# EAGLE design resonatev2 (EAGLE 7.2.0)
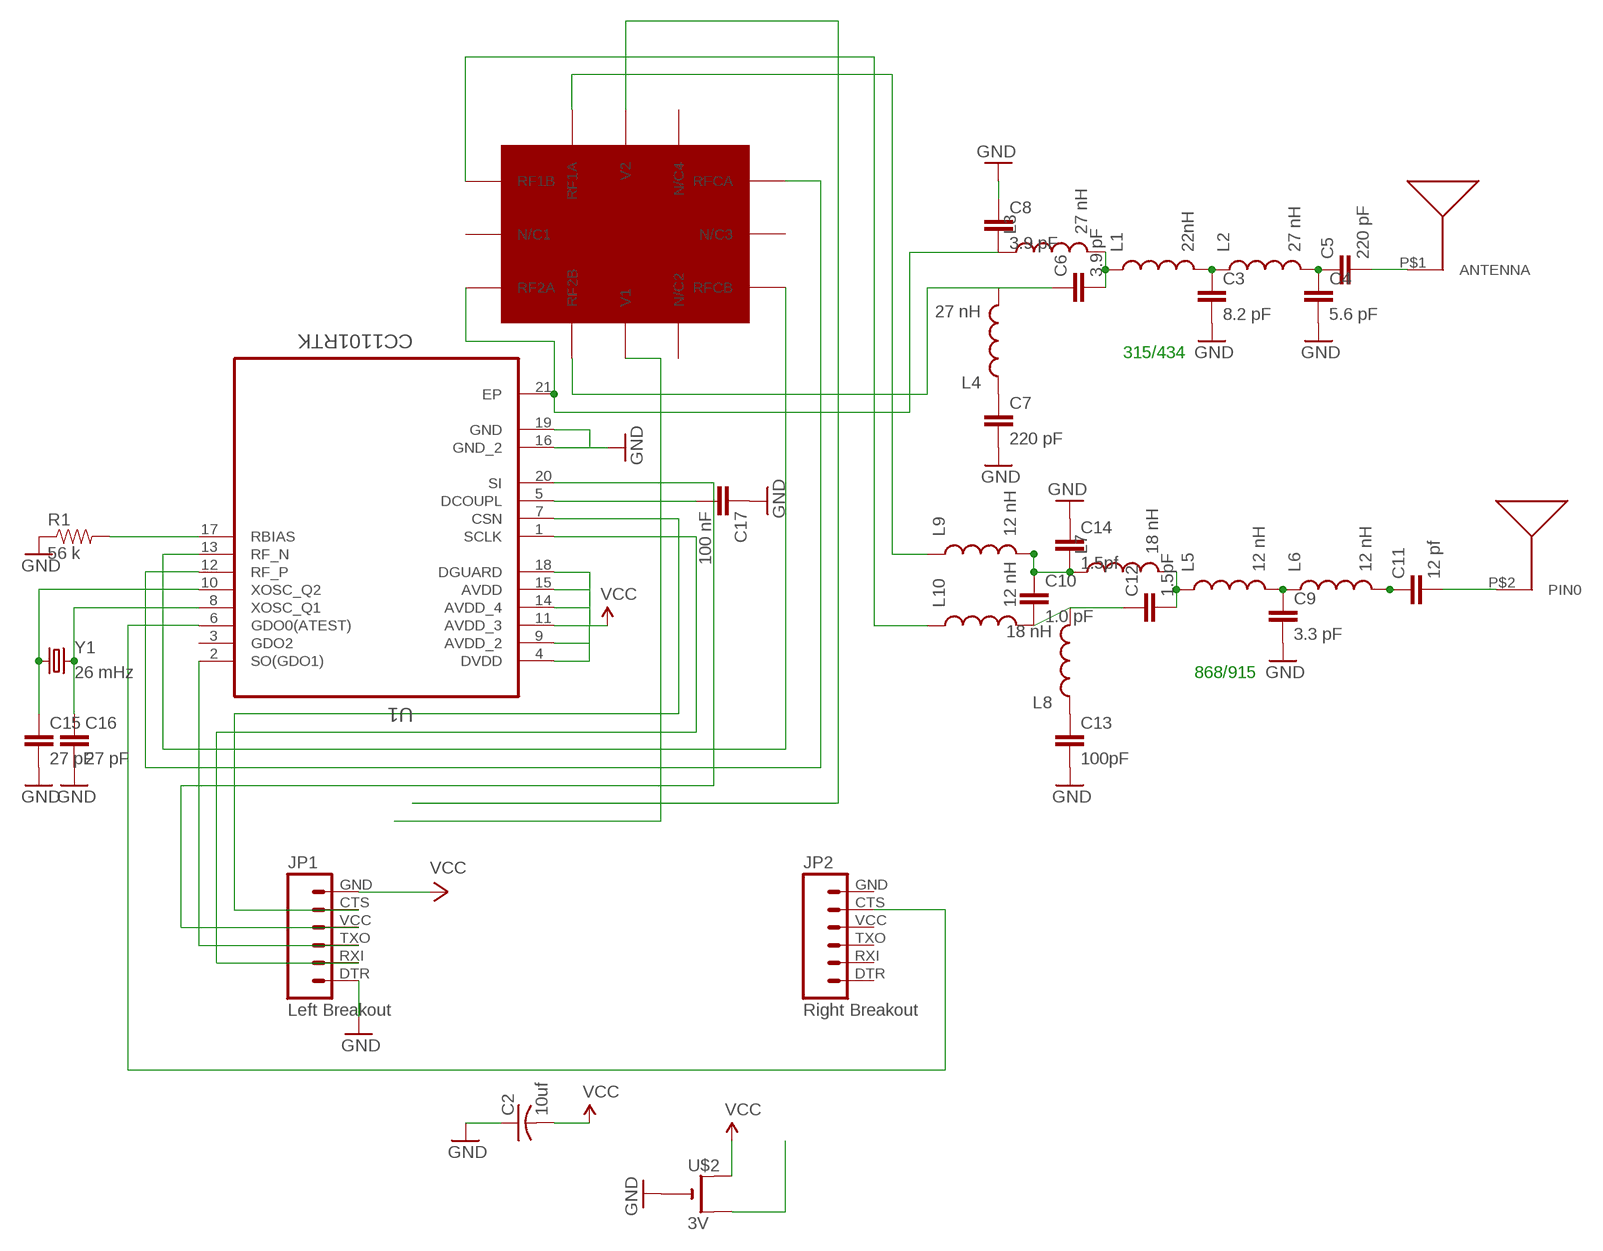
[diagram p0: schematic, sheet 1]

## Parts
C2  10uf  C-USC0603  [C0603]
C3  8.2 pF  CAP0402-CAP  [0402-CAP]
C4  5.6 pF  CAP0402-CAP  [0402-CAP]
C5  220 pF  CAP0402-CAP  [0402-CAP]
C6  3.9 pF  CAP0402-CAP  [0402-CAP]
C7  220 pF  CAP0402-CAP  [0402-CAP]
C8  3.9 pF  CAP0402-CAP  [0402-CAP]
C9  3.3 pF  CAP0402-CAP  [0402-CAP]
C10  1.0 pF  CAP0402-CAP  [0402-CAP]
C11  12 pf  CAP0402-CAP  [0402-CAP]
C12  1.5pF  CAP0402-CAP  [0402-CAP]
C13  100pF  CAP0402-CAP  [0402-CAP]
C14  1.5pf  CAP0402-CAP  [0402-CAP]
C15  27 pF  CAP0402-CAP  [0402-CAP]
C16  27 pF  CAP0402-CAP  [0402-CAP]
C17  100 nF  CAP0402-CAP  [0402-CAP]
JP1  Left Breakout  M06SIP  [1X06]
JP2  Right Breakout  M06SIP  [1X06]
L1  22nH  INDUCTOR0402  [C0402]
L2  27 nH  INDUCTOR0402  [C0402]
L3  27 nH  INDUCTOR0402  [C0402]
L4  27 nH  INDUCTOR0402  [C0402]
L5  12 nH  INDUCTOR0402  [C0402]
L6  12 nH  INDUCTOR0402  [C0402]
L7  18 nH  INDUCTOR0402  [C0402]
L8  18 nH  INDUCTOR0402  [C0402]
L9  12 nH  INDUCTOR0402  [C0402]
L10  12 nH  INDUCTOR0402  [C0402]
R1  56 k  RESISTOR0603-RES  [0603-RES]
U1  CC1101RTK  [QFN50P400X400X90-21N]
U$2  3V  CR2032THM  [CR2032-THRU]
U$3  ANT-868-JJB-ST  [ANT-868-JJB-ST]
U$5  SKY13354-368LF  [SKY13354-368LF]
U$6  ANT1204F002R0433A  [ANT1204F002R0433A]
Y1  26 mHz  CRYSTAL5X3  [CRYSTAL-SMD-5X3]

## Nets
GND: C2.1 C3.2 C4.2 C7.2 C8.1 C9.2 C13.2 C14.1 C15.2 C16.2 C17.1 JP1.DTR R1.1 U1.16(GND_2) U1.19(GND) U$2.-
N$1: U$2.+2(+1)
N$2: JP1.TXO U1.2(SO(GDO1))
N$3: JP2.CTS U1.6(GDO0(ATEST))
N$10: C3.1 L1.2 L2.1
N$11: C4.1 C5.1 L2.2
N$12: C6.1 L4.2 U$5.RF2B
N$13: C7.1 L4.1
N$14: C8.2 L3.1 U1.21(EP) U$5.RF2A
N$15: C9.1 L5.2 L6.1
N$16: C6.2 L1.1 L3.2
N$17: C11.1 L6.2
N$18: C10.2 C12.1 L8.2 L10.2
N$19: C13.1 L8.1
N$20: C10.1 C14.2 L7.1 L9.2
N$21: C12.2 L5.1 L7.2
N$22: C5.2 U$6.P$1(ANTENNA)
N$23: C11.2 U$3.P$2(PIN0)
N$24: U1.12(RF_P) U$5.RFCA
N$25: U1.13(RF_N) U$5.RFCB
N$26: C15.1 U1.10(XOSC_Q2) Y1.1
N$28: L9.1 U$5.RF1A
N$29: L10.1 U$5.RF1B
N$30: C16.1 U1.8(XOSC_Q1) Y1.3
N$31: R1.2 U1.17(RBIAS)
N$32: JP1.VCC U1.20(SI)
N$34: C17.2 U1.5(DCOUPL)
P2: U$5.V1
P3: U$5.V2
P4: JP1.RXI U1.1(SCLK)
P6: JP1.CTS U1.7(CSN)
VCC: C2.2 JP1.GND U1.4(DVDD) U1.9(AVDD_2) U1.11(AVDD_3) U1.14(AVDD_4) U1.15(AVDD) U1.18(DGUARD) U$2.+1(+)
Unconnected: JP2.DTR JP2.GND JP2.RXI JP2.TXO JP2.VCC U1.3(GDO2) U$5.N/C2 U$5.N/C3 U$5.N/C4 U$5.N/C(N/C1)

## Notes on the sheet
- 315/434
- 868/915

## Library data of the parts
C2 = adafruit:C-US: CAPACITOR, American symbol
C3-C17 = SparkFun-Capacitors:CAP: Capacitor Standard 0603 ceramic capacitor, and 0.1" leaded capacitor.
JP1 JP2 = SparkFun-Connectors:M06: Header 6 Standard 6-pin 0.1" header. Use with straight break away headers (SKU : PRT-00116), right angle break away headers (PRT-00553), swiss pins (PRT-00743), machine pins (PRT-00117), and female headers (PRT-00115). Molex polarized connector foot print use with SKU : PRT-08094 with associated crimp pins and housings. NOTES ON THE VARIANTS LOCK and LOCK_LONGPADS... This footprint was designed to help hold the alignment of a through-hole component (i.e. 6-pin header) while soldering it into place. You may notice that each hole has been shifted either up or down by 0.005 of an inch from it's more standard position (which is a perfectly straight line). This slight alteration caused the pins (the squares in the middle) to touch the edges of the holes. Because they are alternating, it causes a "brace" to hold the component in place. 0.005 has proven to be the perfect amount of "off-center" position when using our standard breakaway headers. Although looks a little odd when you look at the bare footprint, once you have a header in there, the alteration is very hard to notice. Also,if you push a header all the way into place, it is covered up entirely on the bottom side. This idea of altering the position of holes to aid alignment will be further integrated into the Sparkfun Library for other footprints. It can help hold any component with 3 or more connection pins.
L1-L10 = SparkFun-Passives:INDUCTOR: Inductors Basic Inductor/Choke - 0603 and 1206. Footprints are not proven and vary greatly between part numbers. SRN6045- 33uH, 20% 1.4A SDR0403-560KL - 56uH, 10%, 500mA RMS/740mA peak
R1 = SparkFun-Passives:RESISTOR: Resistor Basic schematic elements and footprints for 0603, 1206, and PTH resistors.
U1 = Texas Instruments_By_element14_Batch_1:CC1101RTK: Low-Power Sub-1 GHz RF Transceiver; MPN: CC1101RTK; OC_FARNELL: 1555264; OC_NEWARK: 50M8833; PACKAGE: QFN-20; SUPPLIER: Texas Instruments
U$2 = adafruit:CR2032
U$3 = antenna:ANT-868-JJB-ST
U$5 = skyworks:SKY13354-368LF
U$6 = antenna:ANT1204F002R0433A
Y1 = SparkFun-FreqCtrl:CRYSTAL: Various standard crystals. Proven footprints. Spark Fun Electronics SKU : COM-00534

## Board
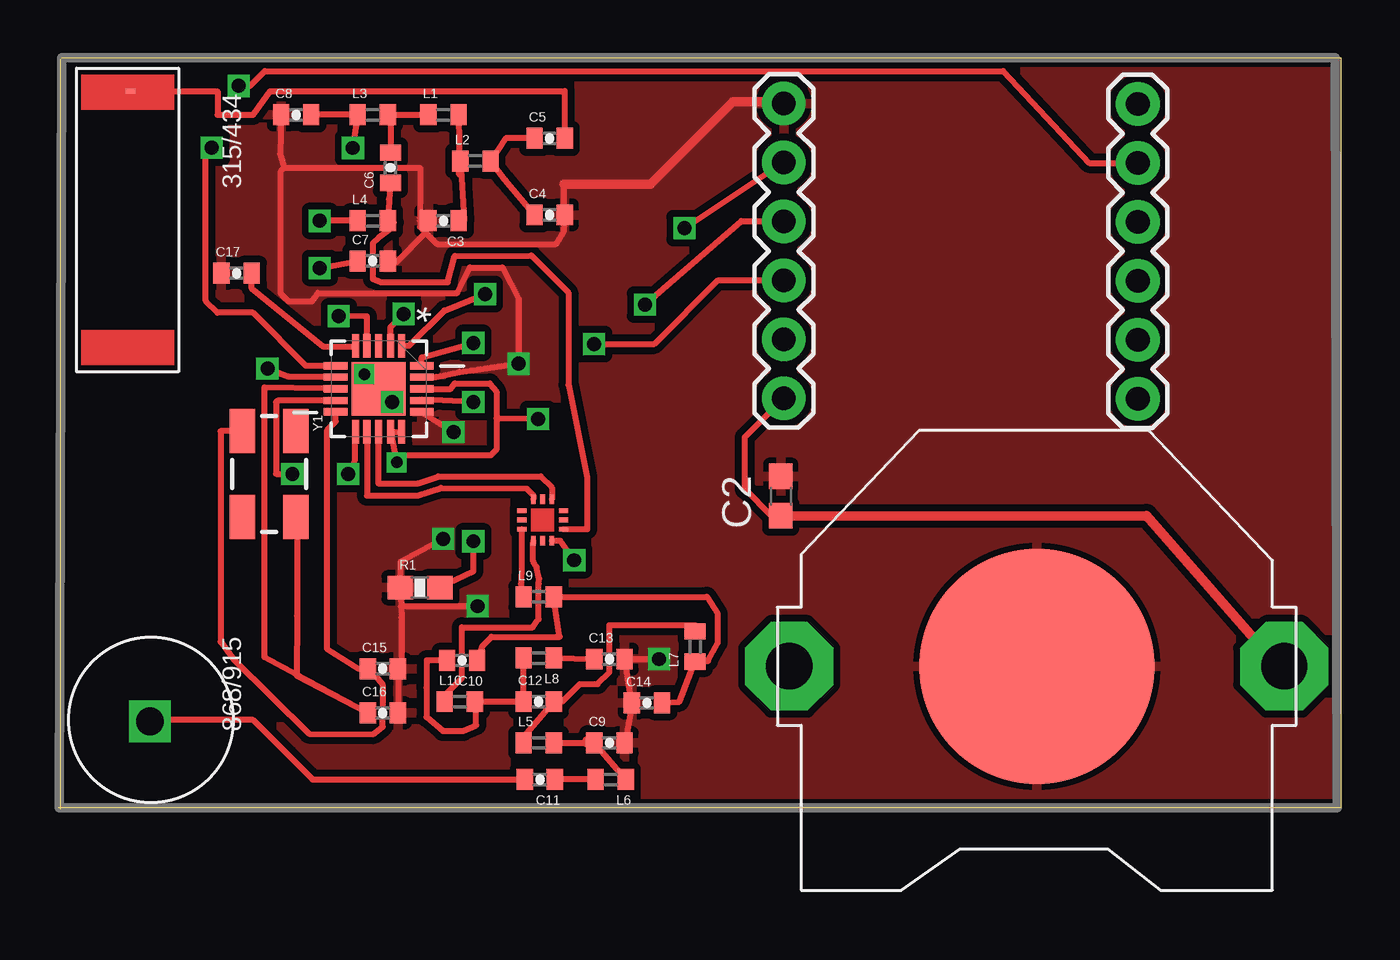
[diagram p1: board, top side]
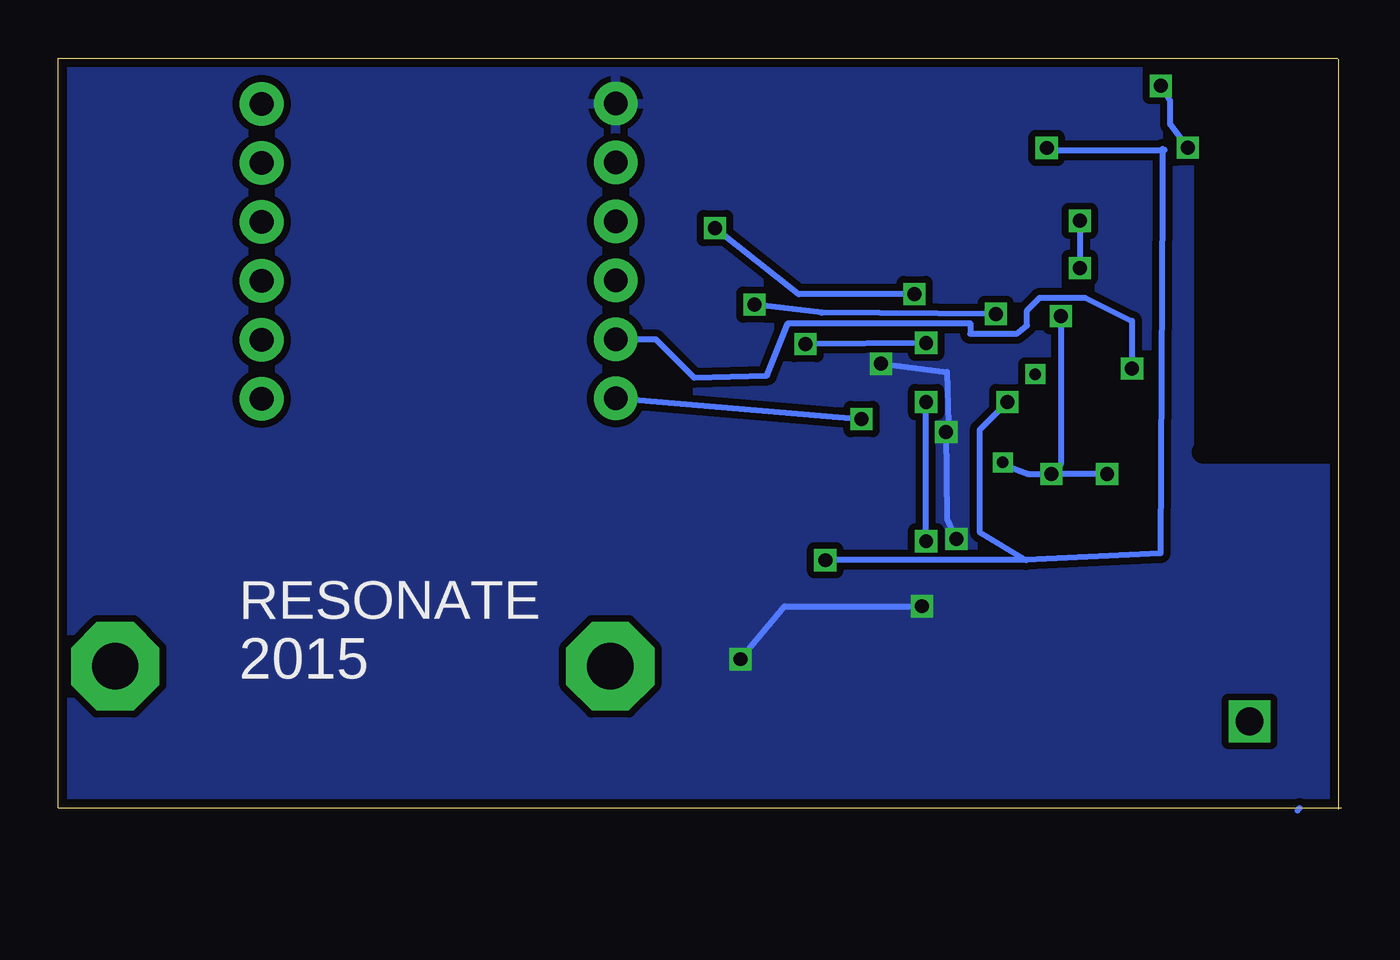
[diagram p2: board, bottom side, seen from below]

Size 55.31 x 32.38 mm. Coordinates in mm from the lower left corner, seen from the top.
Outline: 0.15,32.38 55.31,32.38 55.31,0.05 0,0.05
Outline: 0.11,0 0.11,32.33
Copper layers (1*16): Top 0.0356mm / dielectric 1.5011mm / Bottom 0.0356mm
Design rules "LaenPCBOrder": minimum track width 6mil, minimum drill 13mil, track to track 6mil, track to pad 6mil, pad to pad 6mil, via to via 6mil, smd to smd 6mil, copper to edge 15mil, drill to drill 6mil, minimum pad ring 7mil, minimum via ring 7mil, stop-mask expansion 3mil, vias tented up to drill 0mil, thermal gap 10mil
tRestrict: 4 lines
bRestrict: 4 lines

### Footprints (pad centres in the part's own frame; a part is rotated, then mirrored left to right if it is on the bottom)
C0603 = smd 1.1 x 1: 1 -0.85,0; 2 0.85,0
0402-CAP = smd 0.7 x 0.9: 1 -0.65,0; 2 0.65,0
1X06 = drill 1.016 pad 1.88: CTS 10.16,0; DTR 0,0; GND 12.7,0; RXI 2.54,0; TXO 5.08,0; VCC 7.62,0
C0402 = smd 0.7 x 0.9: 1 -0.65,0; 2 0.65,0
0603-RES = smd 1.1 x 1: 1 -0.85,0; 2 0.85,0
QFN50P400X400X90-21N = smd 1.016 x 0.305: 1 -1.854,0.991; 2 -1.854,0.508; 3 -1.854,0; 4 -1.854,-0.508; 5 -1.854,-0.991; 11 1.854,-0.991; 12 1.854,-0.508; 13 1.854,0; 14 1.854,0.508; 15 1.854,0.991 | smd 0.305 x 1.016: 6 -0.991,-1.854; 7 -0.508,-1.854; 8 0,-1.854; 9 0.508,-1.854; 10 0.991,-1.854; 16 0.991,1.854; 17 0.508,1.854; 18 0,1.854; 19 -0.508,1.854; 20 -0.991,1.854 | smd 2.311 x 2.311: 21 0,0
CR2032-THRU = drill 2 pad 3.81 octagon: +1 -10.668,0; +2 10.668,0 | smd 10.16 x 10.16: - 0,0
ANT-868-JJB-ST = drill 1.2 square: P$2 0.762,-0.762
SKY13354-368LF = smd 0.406 x 0.203: N/C -0.9,0; N/C3 0.9,0; RF1B -0.9,0.4; RF2A -0.9,-0.4; RFCA 0.9,0.4; RFCB 0.9,-0.4 | smd 0.203 x 0.406: N/C2 0.4,-0.9; N/C4 0.4,0.9; RF1A -0.4,0.9; RF2B -0.4,-0.9; V1 0,-0.9; V2 0,0.9
ANT1204F002R0433A = smd 0.203 x 0.406: P$1 0.7,-1.87
CRYSTAL-SMD-5X3 = smd 1.9 x 1.1: 1 -1.85,-1.15; 2 1.85,-1.15; 3 1.85,1.15; 4 -1.85,1.15

### Placement (x,y rotation side)
C2  31.15,13.49 270 top
C3  16.61,25.36 180 top
C4  21.19,25.61 0 top
C5  21.19,28.92 0 top
C6  14.33,27.65 90 top
C7  13.57,23.63 0 top
C8  10.26,29.93 0 top
C9  23.76,2.86 0 top
C10  17.41,6.41 180 top
C11  20.76,1.28 180 top
C12  20.72,4.63 0 top
C13  23.76,6.47 0 top
C14  25.38,4.58 0 top
C15  14,6.05 0 top
C16  14,4.15 0 top
C17  7.69,23.1 0 top
JP1  31.28,30.41 270 top
JP2  46.54,17.69 90 top
L1  16.61,29.93 0 top
L2  17.99,27.94 0 top
L3  13.57,29.93 0 top
L4  13.57,25.36 0 top
L5  20.72,2.86 0 top
L6  23.82,1.28 180 top
L7  27.46,7.01 90 top
L8  20.72,6.51 180 top
L9  20.72,9.15 0 top
L10  17.31,4.63 0 top
R1  15.6,9.55 0 top
U1  13.82,18.12 270 top
U$2  42.18,6.16 180 top
U$3  3.2,4.55 0 top
U$5  20.89,12.46 90 top
U$6  5,31.65 270 top
Y1  9.1,14.45 270 top

### Tracks (layer width: path | path; a pad name or v marks a point on that pad's centre or on a via)
GND  (via drill 0.6)
  Top 0.254: 14.58,23.58 15.85,24.85 | C8.1 9.56,28.24 9.76,27.65 | 9.76,27.65 15.6,27.65 15.6,25.48 C3.2 15.6,25.36 15.6,25.11 15.85,24.85 | 15.85,24.85 16.36,24.34 21.44,24.34 21.79,24.89 C4.2 21.8,25.92 21.8,26.94 | C9.2 24.48,3.04 C14.1 24.66,4.76 C13.2 v25.9,6.47 | C16.2 C15.2 14.8,5.95 14.8,8.25 14.78,8.73 | 14.78,8.73 R1.1 14.75,10.65 v16.6,11.65 | U1.16 v17.04,16.25 | 9.76,27.65 9.6,27.49 9.6,22.22 9.92,21.9 10.95,21.9 11.2,22.25 17.2,22.25 17.75,23.35 19.15,23.35 19.85,22 v19.85,19.2 17.3,18.85 16.3,18.63 U1.19 | v18.08,8.75 14.78,8.73
  Top 0.305: C7.2 14.58,23.58
  Top 0.406: 21.8,26.94 25.54,26.94 29.1,30.5 31.2,30.5 JP1.DTR
  Bottom 0.254: v16.6,11.65 17,12.53 v17.04,16.25 17,16.59 16.95,16.59 17,18.85 v19.85,19.2 | v25.9,6.47 24,8.75 v18.08,8.75
  pour Top (isolate 0.305): 0.15,32.39 55.24,32.39 55.14,0.06 0.05,0.06
  pour Bottom (isolate 0.305): 0.15,32.39 55.24,32.39 55.14,0.06 0.15,0.06
N$2  (via drill 0.6)
  Top 0.254: U1.2 14.33,20.78 v14.9,21.35 | v25.3,21.75 29.45,25.35 31.27,25.35 JP1.TXO
  Bottom 0.254: v14.9,21.35 22.4,21.4 v25.3,21.75
N$3  (via drill 0.6)
  Top 0.254: U1.6 10.69,19.11 8.4,21.4 6.88,21.4 6.37,21.9 6.37,28.25 v6.62,28.51 | v7.79,31.18 8.27,31.18 8.91,31.81 40.73,31.81 44.44,27.85 JP2.CTS
  Bottom 0.254: v6.62,28.51 7.38,29.52 7.38,30.54 v7.79,31.18
N$10
  Top 0.254: L1.2 17.31,27.36 | L2.1 17.49,25.38
  Top 0.305: 17.31,27.36 L2.1 | 17.49,25.38 C3.1
N$11
  Top 0.254: C4.1 19.27,27.12 L2.2 19.29,28.92 C5.1 20.42,28.92
N$12
  Top 0.254: C6.1 14.27,26.28 L4.2 14.47,25.28 14.23,24.94 13.82,24.64 13.56,24.39 13.56,22.87 13.92,22.71 16.8,22.71 17.1,23.85 20.4,23.86 22,22.26 22,18.3 22.8,14.3 22.8,12.06 21.89,12.06 U$5.RF2B
N$13  (via drill 0.6)
  Top 0.254: L4.1 v11.28,25.36 | v11.28,23.33 C7.1
  Bottom 0.254: v11.28,25.36 v11.28,23.33
N$14  (via drill 0.6)
  Top 0.254: C8.2 L3.1 v12.7,28.5 | v22.25,10.73 21.65,11.56 U$5.RF2A | U1.21 v14.4,17.55
  Bottom 0.254: v12.7,28.5 12.7,28.41 7.62,28.41 7.72,28.45 7.72,26.41 7.8,11.03 13.6,10.73 | 13.6,10.73 v22.25,10.73 | v14.4,17.55 15.6,16.35 15.6,11.95 13.6,10.73
N$15
  Top 0.254: L5.2 C9.1 | 22.8,2.95 23.05,2.95 L6.1
  Top 0.406: C9.1 22.8,2.86 22.8,2.95
N$16
  Top 0.254: L1.1 L3.2 14.33,29.93 C6.2
N$17
  Top 0.254: L6.2 C11.1
N$18
  Top 0.254: C10.2 15.89,6.41 15.89,5.65 15.88,5.24 15.88,3.97 16.59,3.36 17.47,3.36 18.02,3.62 18.02,4.64 L10.2 C12.1 L8.2
N$19
  Top 0.254: L8.1 C13.1
N$20
  Top 0.254: C14.2 26.78,4.63 L7.1 | 28,6.4 28.43,7.17 28.43,8.44 27.97,9.15 L9.2 21.62,7.43 18.68,7.43 18.31,7.06 C10.1
  Top 0.305: 28,6.4 L7.1
N$21
  Top 0.254: L5.1 19.84,2.86 C12.2 21.73,4.63 22.49,5.4 23.26,5.4 23.76,5.9 23.76,7.94 27.46,7.94 L7.2
N$22
  Top 0.254: U$6.P$1 6.88,30.95 6.88,29.93 8.4,29.93 9.14,30.95 21.84,30.95 C5.2
N$23
  Top 0.254: 10.8,1.45 10.97,1.28 | 10.97,1.28 C11.2 | 10.97,1.28 8.4,3.85 4.02,3.85 U$3.P$2
N$24
  Top 0.254: U1.12 13.31,13.52 15.5,13.52 16.5,13.85 20.19,13.82 20.49,13.52 U$5.RFCA
N$25
  Top 0.254: U1.13 13.8,16.26 13.8,14.05 15.5,14.05 16.4,14.35 20.8,14.35 21.29,13.86 U$5.RFCB
N$26
  Top 0.254: Y1.1 7,16.3 7,7.22 7.58,6.45 10.82,3.25 13.58,3.23 13.99,3.55 14.01,5.35 13.5,5.99 C15.1 12.94,6.05 11.6,6.89 11.6,16.35 11.97,16.71 U1.10
N$28
  Top 0.254: U$5.RF1A 19.99,10.55 19.95,9.71 19.95,9.34
  Top 0.305: 19.95,9.34 L9.1
N$29
  Top 0.254: 16.51,4.75 17.41,5.65 17.41,7.84 20.46,7.84 20.72,8.19 20.72,9.71 20.73,9.93 20.63,10.43 20.48,10.69 20.48,11.46 U$5.RF1B
  Top 0.305: L10.1 16.51,4.75
N$30
  Top 0.254: Y1.3 10.3,12.6 10.3,8.34 10.29,5.75 C16.1 8.9,6.55 8.9,18.19 11.46,18.15 11.97,18.15 U1.8
N$31  (via drill 0.6)
  Top 0.254: R1.2 17.9,10.25 v17.9,11.55 | v17.9,17.55 15.67,17.65 U1.17
  Bottom 0.254: v17.9,11.55 v17.9,17.55
N$32  (via drill 0.6)
  Top 0.254: U1.20 15.67,19.47 v17.9,20.1 | v23.1,20.05 25.7,20.05 28.45,22.8 JP1.VCC
  Bottom 0.254: v17.9,20.1 v23.1,20.05
N$33  (via drill 0.5)
  other vias: 13.2,18.75
N$34
  Top 0.254: 12.8,20.05 12.83,20.02 U1.5 12.8,19.95 11.42,19.95 8.33,22.47 C17.2
N$38
  Bottom 0.254: 1.9,-0.05 1.8,0.05
P4  (via drill 0.6)
  Top 0.254: U1.1 15.12,19.97 16.65,21.5 18.3,22.15 v18.4,22.2 | v27,25.05 31.26,27.9 JP1.RXI
  Bottom 0.254: v18.4,22.2 23.4,22.2 v27,25.05
P6  (via drill 0.6)
  Top 0.254: v9.03,19 9.93,18.65 11.79,18.65 U1.7
  Bottom 0.254: JP1.CTS 29.56,20.25 27.9,18.6 24.75,18.7 23.85,20.95 16,20.95 16,20.5 14,20.5 13.55,20.85 13.55,21.5 13,22.05 11.05,22.05 9.03,21.04 v9.03,19
VCC  (via drill 0.5 pad 0.25, 0.6)
  Top 0.254: U1.9 9.46,17.61 9.4,17.55 9.4,14.45 v10.1,14.45 | v12.5,14.45 12.8,15.05 12.8,16.23 U1.11 | U1.4 13.31,21.24 v12.1,21.25 | U1.15 U1.14 v14.6,14.95 14.9,15.25 18.65,15.25 18.9,15.5 18.9,16.85 | U1.18 16.92,18.12 17.1,18.35 18.6,18.35 18.9,18 18.9,16.85 | v20.68,16.81 18.9,16.85 | C2.2 30.76,12.64 29.6,13.8 29.6,16.03 JP1.GND
  Top 0.406: U$2.+1 52.6,6.16 46.9,12.65 46.9,12.64 C2.2
  Bottom 0.254: v10.1,14.45 v12.5,14.45 | v12.1,21.25 12.1,14.85 v12.5,14.45 | v14.6,14.95 14.6,14.88 14.63,14.88 13.5,14.45 v12.5,14.45 | JP1.GND v20.68,16.81

### Text on the board
bPlace: RESONATE | 2015
tNames: 315/434 | 868/915